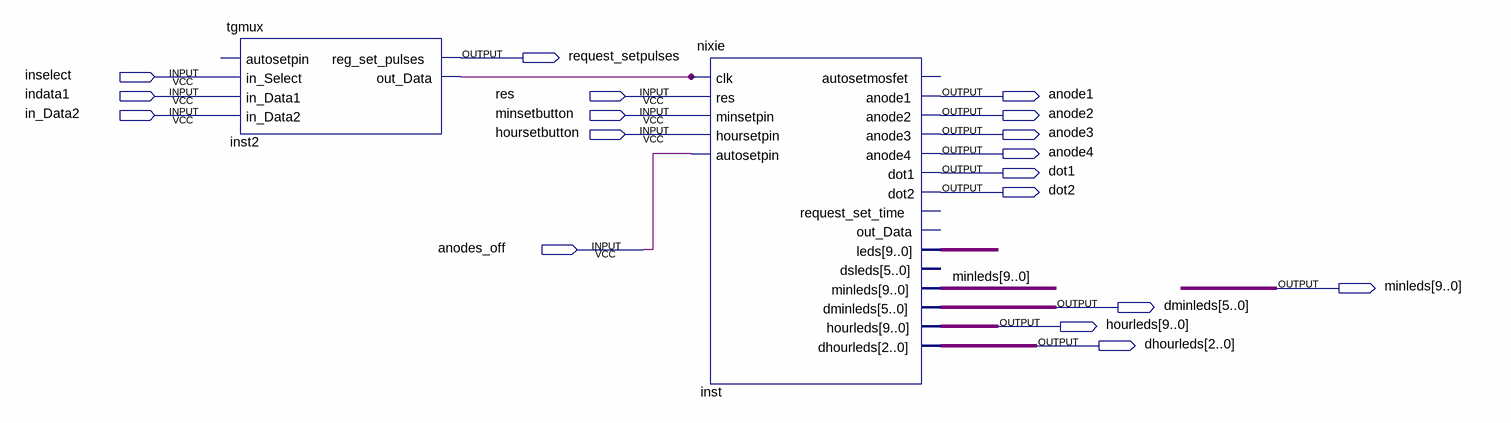
[diagram p0: schematic sheet]
// Quartus schematic complete-nixie.bdf as structural Verilog: 2 symbols, 18 pins
module \complete-nixie  (
  input  inselect,
  input  indata1,
  input  res,
  input  in_Data2,
  input  minsetbutton,
  input  hoursetbutton,
  input  anodes_off,
  output request_setpulses,
  output anode1,
  output anode2,
  output anode3,
  output anode4,
  output dot1,
  output dot2,
  output [9:0] minleds,
  output [5:0] dminleds,
  output [9:0] hourleds,
  output [2:0] dhourleds
);

  wire inst2_out_data;
  wire [9:0] inst_leds;

  tgmux inst2 (
    .in_Select(inselect), .in_Data1(indata1), .in_Data2(in_Data2), .reg_set_pulses(request_setpulses),
    .out_Data(inst2_out_data));  // open: autosetpin
  nixie inst (
    .clk(inst2_out_data), .res(res), .minsetpin(minsetbutton), .hoursetpin(hoursetbutton),
    .autosetpin(anodes_off), .anode1(anode1), .anode2(anode2), .anode3(anode3), .anode4(anode4), .dot1(dot1),
    .dot2(dot2), .leds(inst_leds), .minleds(minleds), .dminleds(dminleds), .hourleds(hourleds),
    .dhourleds(dhourleds));  // open: autosetmosfet, request_set_time, out_Data, dsleds
endmodule
